# Altium schematic sheet POWER.SchDoc: TE0722
size A; Date: 07.11.2014; Organization: Trenz Electronic GmbH; DocumentNumber: 1; Revision: 01; SheetNumber: 1; SheetTotal: 8
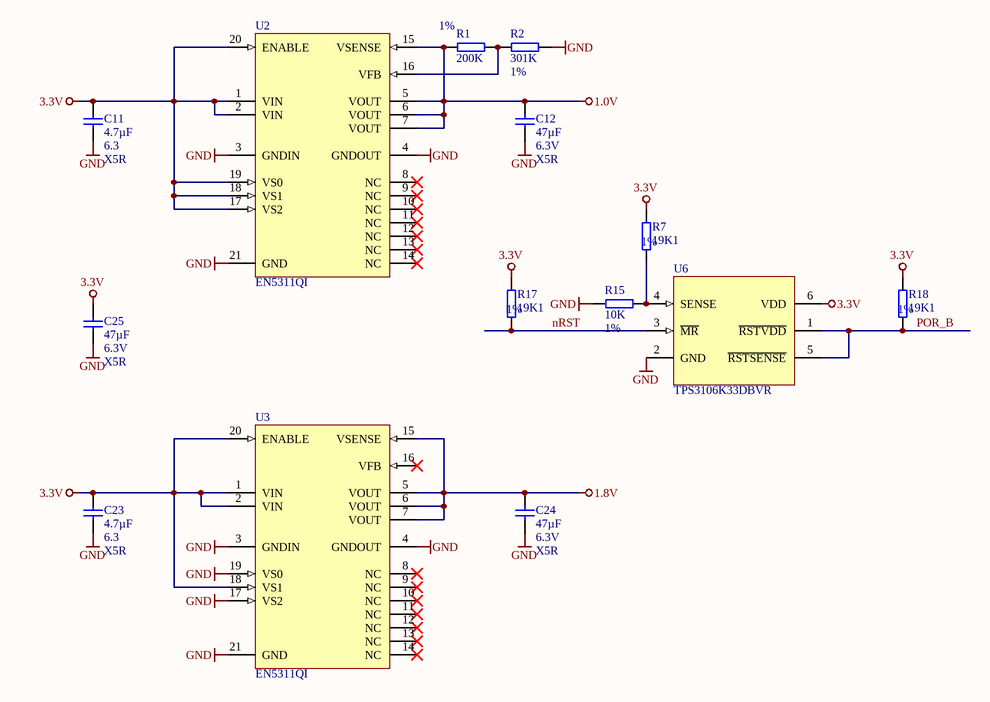
[diagram p0: POWER.SchDoc]

## Parts
C11  4.7µF  Voltage: 6.3  Technology: X5R  [CAPC1005X60N]
C12  47µF  Voltage: 6.3V  Technology: X5R  [CAPC2012X135N]
C23  4.7µF  Voltage: 6.3  Technology: X5R  [CAPC1005X60N]
C24  47µF  Voltage: 6.3V  Technology: X5R  [CAPC2012X135N]
C25  47µF  Voltage: 6.3V  Technology: X5R  [CAPC2012X135N]
R1  200K  Tolerance: 1%  [RESC1005X40N]
R2  301K  Tolerance: 1%  [RESC1005X40N]
R7  19K1  Tolerance: 1%  [RESC0603X26N]
R15  10K  Tolerance: 1%  [RESC0603X26N]
R17  19K1  Tolerance: 1%  [RESC0603X26N]
R18  19K1  Tolerance: 1%  [RESC0603X26N]
U2  EN5311QI  [EN5311QI]
U3  EN5311QI  [EN5311QI]
U6  TPS3106K33DBVR  [SOT95P280X145-6N]

## Nets
1.0V: C12.1 R1.1 U2.5(VOUT) U2.6(VOUT) U2.7(VOUT) U2.15(VSENSE)
1.8V: C24.1 U3.5(VOUT) U3.6(VOUT) U3.7(VOUT) U3.15(VSENSE)
3.3V: C11.1 C23.1 C25.1 R7.2 R17.2 R18.2 U2.1(VIN) U2.2(VIN) U2.17(VS2) U2.18(VS1) U2.19(VS0) U2.20(ENABLE) U3.1(VIN) U3.2(VIN) U3.18(VS1) U3.20(ENABLE) U6.6(VDD)
GND: C11.2 C12.2 C23.2 C24.2 C25.2 R2.2 R15.1 U2.3(GNDIN) U2.4(GNDOUT) U2.21(GND) U3.3(GNDIN) U3.4(GNDOUT) U3.17(VS2) U3.19(VS0) U3.21(GND) U6.2(GND)
nRST: R17.1 U6.3(~{MR})
POR_B: R18.1 U6.1(~{RSTVDD}) U6.5(~{RSTSENSE})
NetR1_2: R1.2 R2.1 U2.16(VFB)
NetR7_1: R7.1 R15.2 U6.4(SENSE)

Not connected (* = marked no-connect by the designer): U2 8(NC)* 9(NC)* 10(NC)* 11(NC)* 12(NC)* 13(NC)* 14(NC)*; U3 8(NC)* 9(NC)* 10(NC)* 11(NC)* 12(NC)* 13(NC)* 14(NC)* 16(VFB)*

## Library data of the parts
C11 C23 = 24719: KON 4.7µF 6.3V X5R SMD 20%; AN: 24719; Mixed: SMT; Value: 4.7u; Preferred: Yes; Case: 1005 (0402); Tolerance: 20%
C12 C24 C25 = 24718: KON 47µF 6,3V  X5R SMD 20%; AN: 24718; Mixed: SMT; Value: 47u; Preferred: Yes; Case: 2012 (0805); Tolerance: 20%
R1 = 23846: WID SMD 200K 1% 0,063W; AN: 23846; Mixed: SMT; Preferred: Yes; Case: 1005 (0402); Value: 200K
R2 = 26224: WID SMD 301K 1% 0,063W; AN: 26224; Mixed: SMT; Case: 1005 (0402); Value: 301k
R7 R17 R18 = 25053: WID SMD 19K1 1% 0,05W; AN: 25053; Mixed: SMT; Value: 19.1K; Case: 0603 (0201); HelpURL: B:\AD\adlib\datasheet\R0201
R15 = 24914: WID SMD 10K 1% 0,05W; AN: 24914; Mixed: SMT; Preferred: Yes; Case: 0603 (0201); Value: 10K; HelpURL: B:\AD\adlib\datasheet\R0201
U2 U3 = 25492: AN: 25492; Mixed: SMT; Trenz-Stock: Yes; Case: QFN20; HelpURL: B:\AD\adlib\datasheet\EN5311QI; Preferred: Yes
U6 = 26439: AN: 26439; Mixed: SMT; Case: SOT23-6; HelpURL: B:\ad\adlib\datasheet\TPS3106